# EAGLE design gloBrdA (EAGLE 6.4)
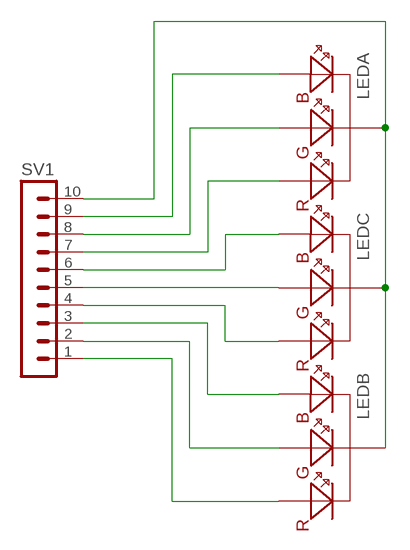
[diagram p0: schematic, sheet 1]

## Parts
LEDA  MULTICOLORLED  [MULTICOLORLED]
LEDB  MULTICOLORLED  [MULTICOLORLED]
LEDC  MULTICOLORLED  [MULTICOLORLED]
SV1  MA10-1  [MA10-1]

## Nets
GND: LEDA.GND LEDB.GND LEDC.GND SV1.10
N$1: LEDC.LED-G SV1.5
N$11: LEDA.LED-B SV1.9
N$12: LEDA.LED-G SV1.8
N$13: LEDA.LED-R SV1.7
N$14: LEDC.LED-B SV1.6
N$16: LEDC.LED-R SV1.4
N$17: LEDB.LED-B SV1.3
N$18: LEDB.LED-G SV1.2
N$19: LEDB.LED-R SV1.1

## Library data of the parts
LEDA LEDB LEDC = knolleary:MULTICOLORLED
SV1 = con-lstb:MA10-1: PIN HEADER; OC_FARNELL: unknown; OC_NEWARK: unknown

## Board
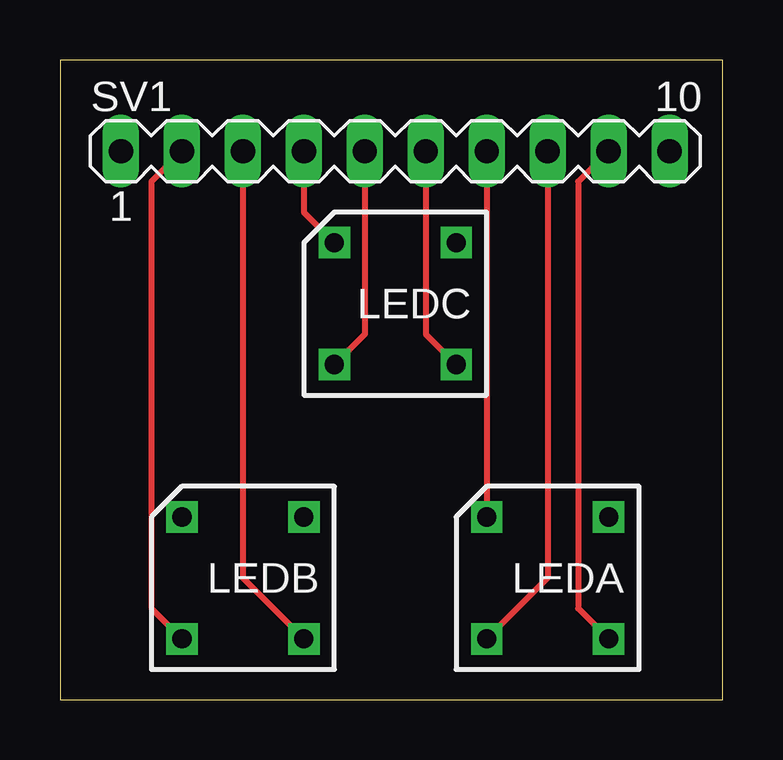
[diagram p1: board, top side]
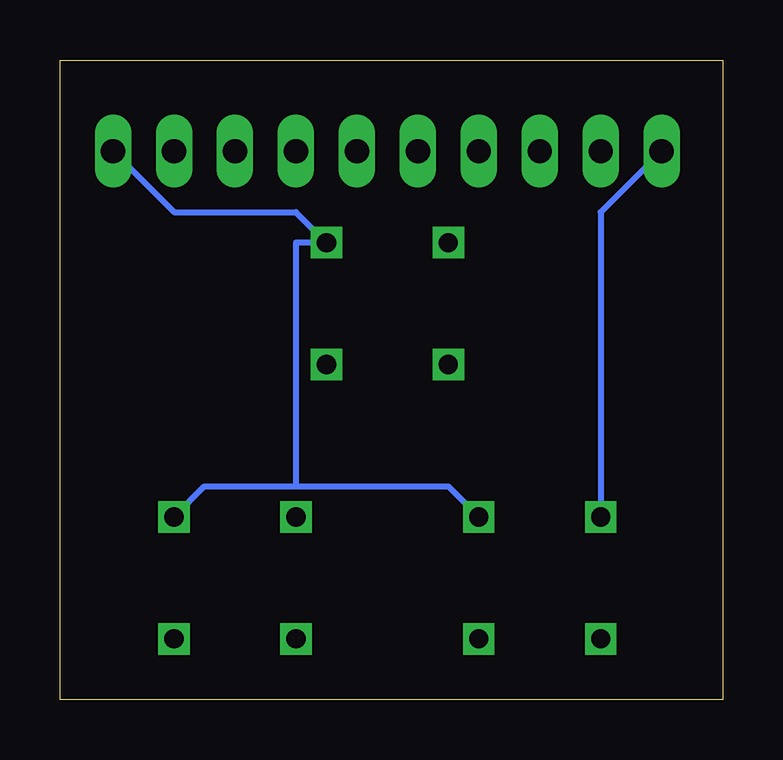
[diagram p2: board, bottom side, seen from below]

Size 27.61 x 26.66 mm. Coordinates in mm from the lower left corner, seen from the top.
Outline: 0,0 27.61,0 27.61,26.66 0,26.66 0,0
Copper layers (1*16): Top 0.035mm / dielectric 1.5mm / Bottom 0.035mm
Design rules "default": minimum track width 10mil, minimum drill 24mil, track to track 8mil, track to pad 8mil, pad to pad 8mil, via to via 8mil, smd to smd 8mil, copper to edge 40mil, drill to drill 8mil, minimum pad ring 10mil, minimum via ring 8mil, stop-mask expansion 4mil, vias tented up to drill 0mil, thermal gap 10mil

### Footprints (pad centres in the part's own frame; a part is rotated, then mirrored left to right if it is on the bottom)
MULTICOLORLED = drill 0.8 square: GND -2.54,-2.54; LED-B -2.54,2.54; LED-G 2.54,2.54; LED-R 2.54,-2.54
MA10-1 = drill 1.016 long: 1 -11.43,0; 2 -8.89,0; 3 -6.35,0; 4 -3.81,0; 5 -1.27,0; 6 1.27,0; 7 3.81,0; 8 6.35,0; 9 8.89,0; 10 11.43,0

### Placement (x,y rotation side)
LEDA  20.32,5.08 180 top
LEDB  7.62,5.08 180 top
LEDC  13.97,16.51 180 top
SV1  13.97,22.86 0 top

### Tracks (layer width: path | path; a pad name or v marks a point on that pad's centre or on a via)
GND
  Bottom 0.254: LEDB.GND 11.43,8.89 17.78,8.89 | 17.78,8.89 21.59,8.89 LEDA.GND | SV1.10 22.86,20.32 17.78,20.32 LEDC.GND 17.78,19.05 17.78,8.89
N$1
  Top 0.254: LEDC.LED-G 12.7,15.24 SV1.5
N$11
  Top 0.254: LEDA.LED-B 21.59,3.81 21.59,21.59 SV1.9
N$12
  Top 0.254: LEDA.LED-G 20.32,5.08 SV1.8
N$13
  Top 0.254: SV1.7 LEDA.LED-R
N$14
  Top 0.254: LEDC.LED-B 15.24,15.24 SV1.6
N$16
  Top 0.254: LEDC.LED-R 10.16,20.32 SV1.4
N$17
  Top 0.254: LEDB.LED-B 7.62,5.08 SV1.3
N$18
  Top 0.254: LEDB.LED-G 3.81,3.81 3.81,21.59 SV1.2
N$19
  Bottom 0.254: LEDB.LED-R 5.08,20.32 SV1.1